# EAGLE design MiMo-Light-V2.0 (EAGLE 8.7.0)
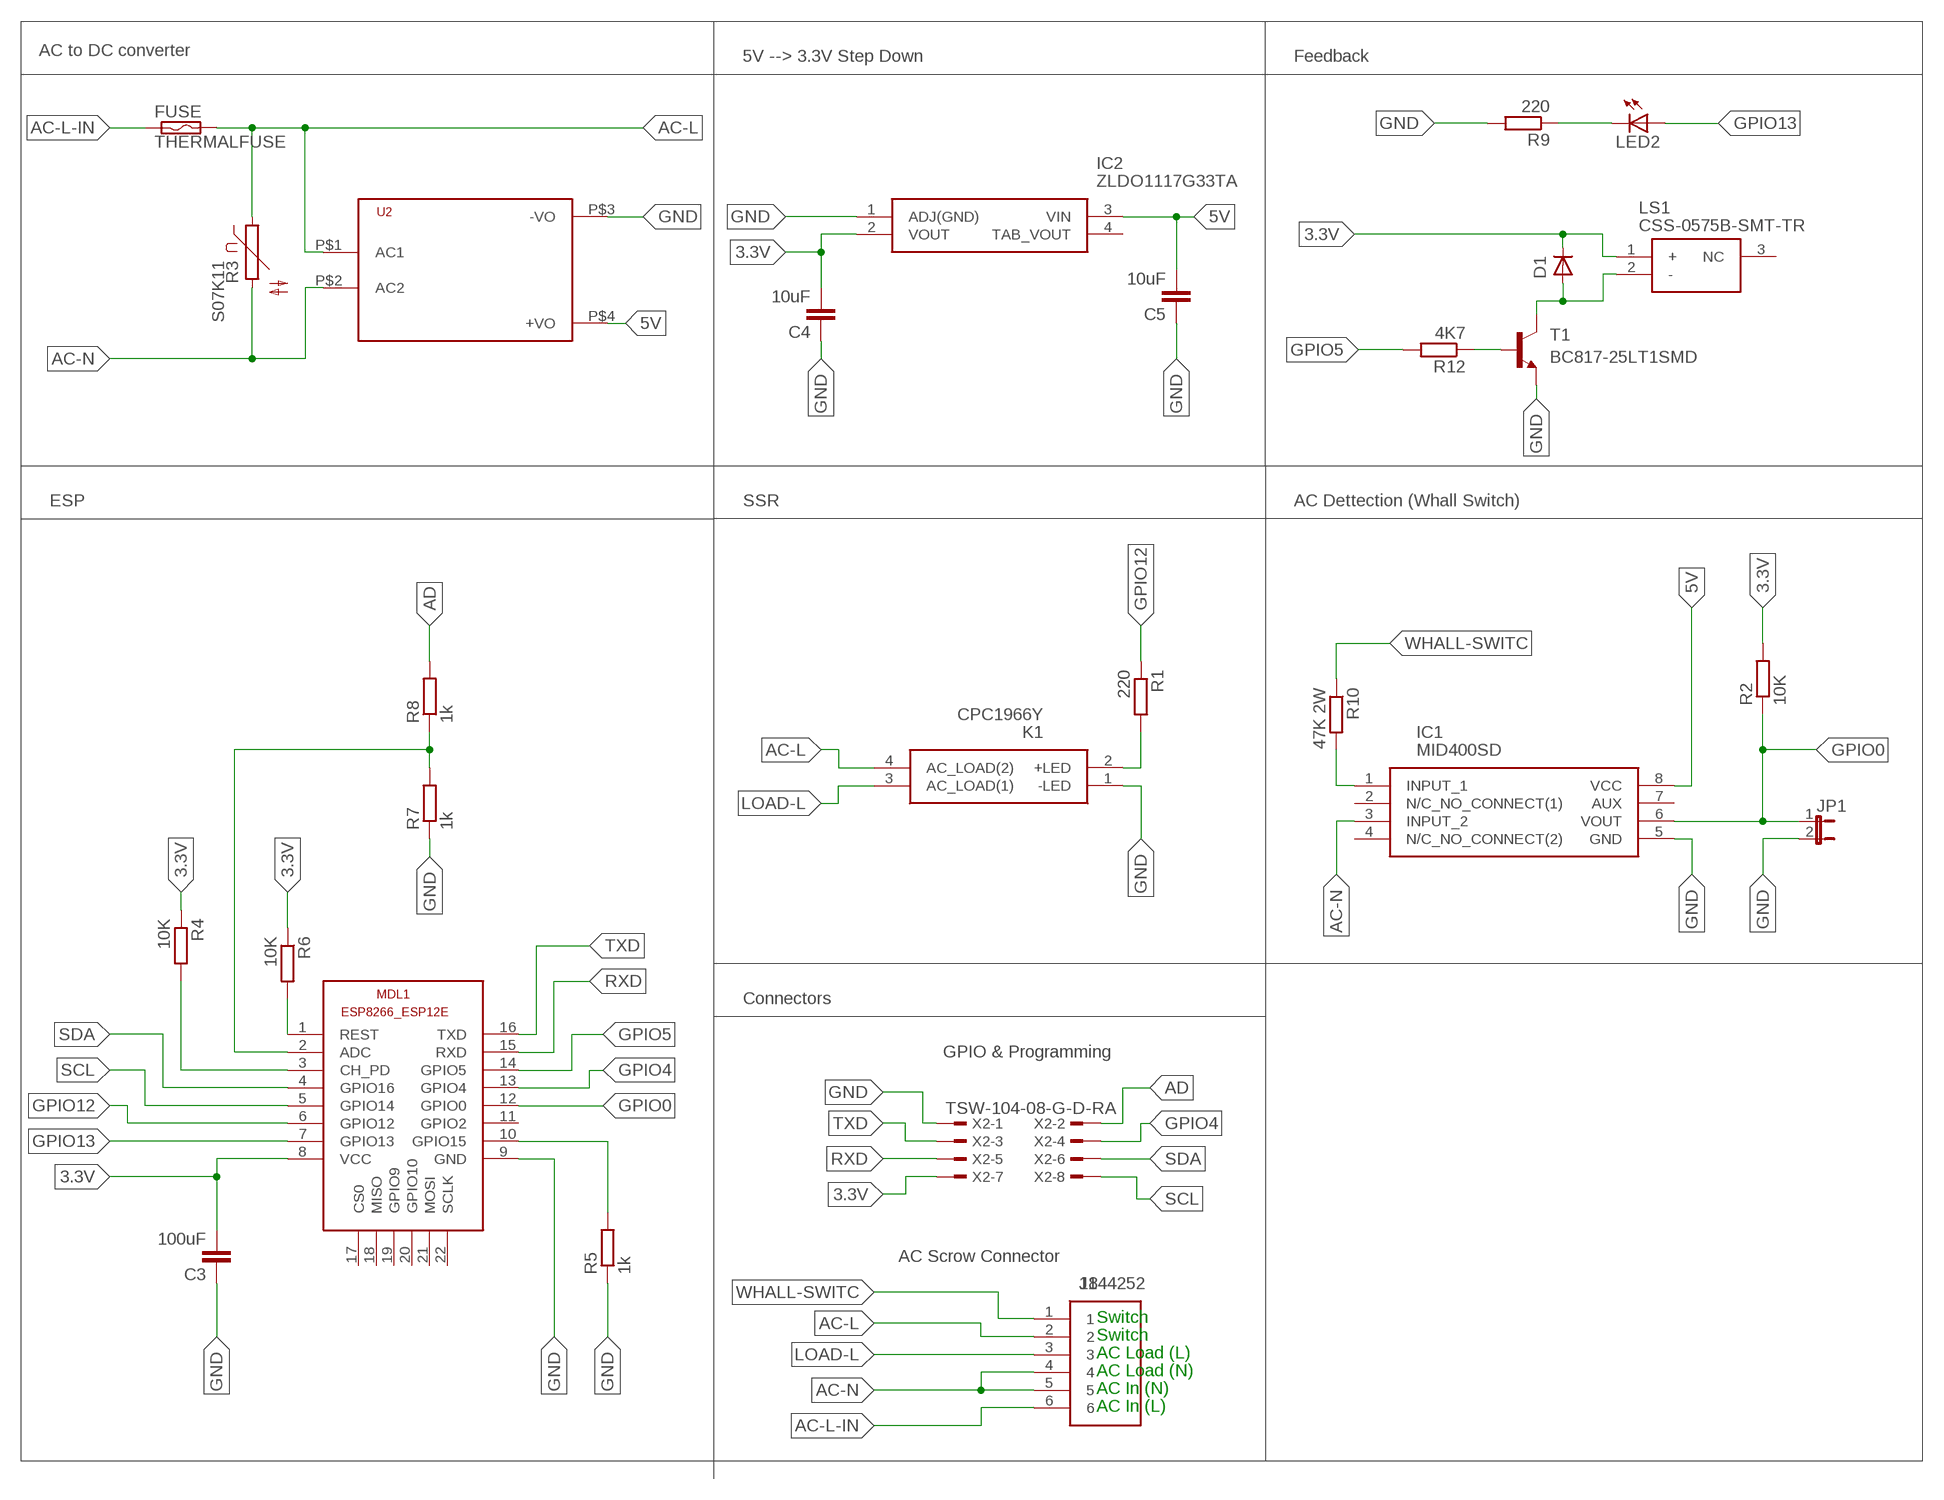
[diagram p0: schematic, sheet 1]

## Parts
C3  100uF  CAP1210  [1210]
C4  10uF  CAP1206  [1206]
C5  10uF  CAP1206  [1206]
D1  DIODE-MINIMELF  [MINIMELF]
FUSE  THERMALFUSE  THERMALFUSE12MM  [TE5]
IC1  MID400SD  [SOP254P1030X508-8N]
IC2  ZLDO1117G33TA  [SOT230P700X180-4N]
J1  1844252  [SHDR6W100P0X350_1X6_2240X920X7]
JP1  JP1E  [JP1]
K1  CPC1966Y  [CPC1966Y]
LED2  LEDCHIPLED_1206  [CHIPLED_1206]
LS1  CSS-0575B-SMT-TR  [CSS-0575B-SMT-TR]
MDL1  ESP8266-12EESP8266-ESP12E  [ESP8266-ESP12E]
R1  220  RR1206  [R1206]
R2  10K  RR1206  [R1206]
R3  S07K11  [S07K11]
R4  10K  RR1206  [R1206]
R5  1k  RR1206  [R1206]
R6  10K  RR1206  [R1206]
R7  1k  RR1206  [R1206]
R8  1k  RR1206  [R1206]
R9  220  RR1206  [R1206]
R10  47K 2W  RR2512  [R2512]
R12  4K7  RR1206  [R1206]
T1  BC817-25LT1SMD  [SOT23-BEC]
U2  HLK-PM013W  [HLK-PM01]
X2  TSW-104-08-G-D-RA  [TSW-104-08-G-D-RA]

## Nets
3.3V: C3.2 C4.2 D1.C IC2.2(VOUT) LS1.1(+) MDL1.8(VCC) R2.2 R4.1 R6.1 X2.7
5V: C5.2 IC1.8(VCC) IC2.3(VIN) U2.P$4(+VO)
AC-DETECT [AC-detect]: IC1.1(INPUT_1) R10.2
AC-L [AC]: FUSE.2 J1.2 K1.4(AC_LOAD(2)) R3.1 U2.P$1(AC1)
AC-L-IN [AC]: FUSE.1 J1.6
AC-N [AC]: IC1.3(INPUT_2) J1.4 J1.5 R3.2 U2.P$2(AC2)
AD: R8.2 X2.2
ADC: MDL1.2(ADC) R7.2 R8.1
GND: C3.1 C4.1 C5.1 IC1.5(GND) IC2.1(ADJ(GND)) JP1.2 K1.1(-LED) MDL1.9(GND) R5.1 R7.1 R9.2 T1.E U2.P$3(-VO) X2.1
GPIO0: IC1.6(VOUT) JP1.1 MDL1.12(GPIO0) R2.1
GPIO4: MDL1.13(GPIO4) X2.4
GPIO5: MDL1.14(GPIO5) R12.2
GPIO12: MDL1.6(GPIO12) R1.1
GPIO13: LED2.A MDL1.7(GPIO13)
LOAD-L [AC]: J1.3 K1.3(AC_LOAD(1))
N$2: LED2.C R9.1
N$3: K1.2(+LED) R1.2
N$5: D1.A LS1.2(-) T1.C
N$6: MDL1.3(CH_PD) R4.2
N$7: R12.1 T1.B
N$8: MDL1.10(GPIO15) R5.2
N$11: MDL1.1(REST) R6.2
RXD: MDL1.15(RXD) X2.5
SCL: MDL1.5(GPIO14) X2.8
SDA: MDL1.4(GPIO16) X2.6
TXD: MDL1.16(TXD) X2.3
WHALL-SWITC [AC-detect]: J1.1 R10.1
Unconnected: IC1.2(N/C_NO_CONNECT(1)) IC1.4(N/C_NO_CONNECT(2)) IC1.7(AUX) IC2.4(TAB_VOUT) LS1.3(NC) MDL1.11(GPIO2) MDL1.17(CS0) MDL1.18(MISO) MDL1.19(GPIO9) MDL1.20(GPIO10) MDL1.21(MOSI) MDL1.22(SCLK)

## Notes on the sheet
- AC to DC converter
- 5V --> 3.3V Step Down | Feedback
- ESP | SSR | AC Dettection (Whall Switch)
- Connectors
- GPIO & Programming
- AC Scrow Connector
- Switch
- Switch
- AC Load (L)
- AC Load (N)
- AC In (N)
- AC In (L)

## Library data of the parts
C3-C5 = SparkFun-Capacitors:CAP: Capacitor Standard 0603 ceramic capacitor, and 0.1" leaded capacitor.
D1 = diode:DIODE-: DIODE
FUSE = Marco-Lib:THERMALFUSE
IC1 = SamacSys_Parts:MID400SD: Logic Output Optocouplers 8-Pin Optocoupler Logic aC Line Source: Datasheet <https://componentsearchengine.com/Datasheets/1/MID400SD.pdf>; DESCRIPTION: Logic Output Optocouplers 8-Pin Optocoupler Logic aC Line; HEIGHT: 5.08mm; MANUFACTURER_NAME: Fairchild Semiconductor; MANUFACTURER_PART_NUMBER: MID400SD; RS_PART_NUMBER: 8064169P; RS_PRICE/STOCK: http://uk.rs-online.com/web/p/products/8064169P
IC2 = SamacSys_Parts:ZLDO1117G33TA: LDO Regulator Pos 3.3V 1A 4Pin SOT223 Diodes Inc ZLDO1117G33TA, Single Linear Voltage Regulator, 1A 3.3 V, 2%, 3-Pin SOT-223 Source: Datasheet <http://uk.rs-online.com/web/p/products/7515183P>; ALLIED_NUMBER: 70438621; DESCRIPTION: LDO Regulator Pos 3.3V 1A 4Pin SOT223 Diodes Inc ZLDO1117G33TA, Single Linear Voltage Regulator, 1A 3.3 V, 2%, 3-Pin SOT-223; HEIGHT: 1.8mm; MANUFACTURER_NAME: Diodes Inc.; MANUFACTURER_PART_NUMBER: ZLDO1117G33TA; RS_PART_NUMBER: 7515183P
J1 = SamacSys_Parts:1844252: Mini PCB header, R/A, 3.5mm pitch, 6 way Source: Datasheet <http://uk.rs-online.com/web/p/products/8042257>; DESCRIPTION: Mini PCB header, R/A, 3.5mm pitch, 6 way; HEIGHT: 7.25mm; MANUFACTURER_NAME: Phoenix Contact; MANUFACTURER_PART_NUMBER: 1844252; RS_PART_NUMBER: 8042257
JP1 = jumper:JP1E: JUMPER
K1 = SamacSys_Parts:CPC1966Y: IXYS 3 A rms SPNO Solid State Relay, Zero Crossing, PCB Mount SCR, 240 V ac Maximum Load Source: Datasheet <http://uk.rs-online.com/web/p/products/9061091>; DESCRIPTION: IXYS 3 A rms SPNO Solid State Relay, Zero Crossing, PCB Mount SCR, 240 V ac Maximum Load; HEIGHT: 10mm; MANUFACTURER_NAME: IXYS SEMICONDUCTOR; MANUFACTURER_PART_NUMBER: CPC1966Y; RS_PART_NUMBER: 9061091
LED2 = led:LED: LED OSRAM: - CHIPLED LG R971, LG N971, LY N971, LG Q971, LY Q971, LO R971, LY R971 LH N974, LH R974 LS Q976, LO Q976, LY Q976 LO Q996 - Hyper CHIPLED LW Q18S LB Q993, LB Q99A, LB R99A - SideLED LS A670, LO A670, LY A670, LG A670, LP A670 LB A673, LV A673, LT A673, LW A673 LH A674 LY A675 LS A676, LA A676, LO A676, LY A676, LW A676 LS A679, LY A679, LG A679 - Hyper Micro SIDELED® LS Y876, LA Y876, LO Y876, LY Y876 LT Y87S - SmartLED LW L88C, LW L88S LB L89C, LB L89S, LG L890 LS L89K, LO L89K, LY L89K LS L896, LA L896, LO L896, LY L896 - TOPLED LS T670, LO T670, LY T670, LG T670, LP T670 LSG T670, LSP T670, LSY T670, LOP T670, LYG T670 LG T671, LOG T671, LSG T671 LB T673, LV T673, LT T673, LW T673 LH T674 LS T676, LA T676, LO T676, LY T676, LB T676, LH T676, LSB T676, LW T676 LB T67C, LV T67C, LT T67C, LS T67K, LO T67K, LY T67K, LW E67C LS E67B, LA E67B, LO E67B, LY E67B, LB E67C, LV E67C, LT E67C LW T67C LS T679, LY T679, LG T679 LS T770, LO T770, LY T770, LG T770, LP T770 LB T773, LV T773, LT T773, LW T773 LH T774 LS E675, LA E675, LY E675, LS T675 LS T776, LA T776, LO T776, LY T776, LB T776 LHGB T686 LT T68C, LB T68C - Hyper Mini TOPLED® LB M676 - Mini TOPLED Santana® LG M470 LS M47K, LO M47K, LY M47K Source: http://www.osram.convergy.de LUXEON: - LUMILED® LXK2-PW12-R00, LXK2-PW12-S00, LXK2-PW14-U00, LXK2-PW14-V00 LXK2-PM12-R00, LXK2-PM12-S00, LXK2-PM14-U00 LXK2-PE12-Q00, LXK2-PE12-R00, LXK2-PE12-S00, LXK2-PE14-T00, LXK2-PE14-U00 LXK2-PB12-K00, LXK2-PB12-L00, LXK2-PB12-M00, LXK2-PB14-N00, LXK2-PB14-P00, LXK2-PB14-Q00 LXK2-PR12-L00, LXK2-PR12-M00, LXK2-PR14-Q00, LXK2-PR14-R00 LXK2-PD12-Q00, LXK2-PD12-R00, LXK2-PD12-S00 LXK2-PH12-R00, LXK2-PH12-S00 LXK2-PL12-P00, LXK2-PL12-Q00, LXK2-PL12-R00 Source: www.luxeon.com KINGBRIGHT: KA-3528ASYC Source: www.kingbright.com
LS1 = SamacSys_Parts:CSS-0575B-SMT-TR: Speakers & Transducers buzzer, 5 mm square, 2.5 mm deep, M, 4 kHz, 3 V, SMT, no driving circuit Source: Datasheet <http://www.cui.com/product/resource/css-0575b-smt.pdf>; DESCRIPTION: Speakers & Transducers buzzer, 5 mm square, 2.5 mm deep, M, 4 kHz, 3 V, SMT, no driving circuit; HEIGHT: mm; MANUFACTURER_NAME: CUI; MANUFACTURER_PART_NUMBER: CSS-0575B-SMT-TR
MDL1 = ESP8266-ESP12E:ESP8266-12E: ESP8266-12E with additional I/O and GPIO04/05 corrected The author cannot warrant that this library is free from error or will meet your specific requirements. Created by PuceBaboon.com. Komagane, Nagano, JAPAN
R1 R2 R4-R10 R12 = eagle-ltspice:R: RESISTOR, European symbol; SPICEMODEL: NONE; SPICEPREFIX: R
R3 = varistor:S07K11: VARISTOR
T1 = transistor-npn:BC817*: NPN Transistor
U2 = HLK-PM01:HLK-PM01: Hi-Link Power Supply HLK-PM01 3W Author: Ahmed Said <https://github.com/AhmedSaid/EAGLELibraries>
X2 = con-samtec:TSW-104-*-G: THROUGH-HOLE .025" SQ POST HEADER Source: Samtec TSW.pdf; MF: Samtec Inc.; MPN: TSW-104-08-G-D-RA

## Net classes
1 AC: width 1.524 mm, clearance 0.762 mm
2 AC-detect: width 0.762 mm, clearance 1.016 mm

## Board
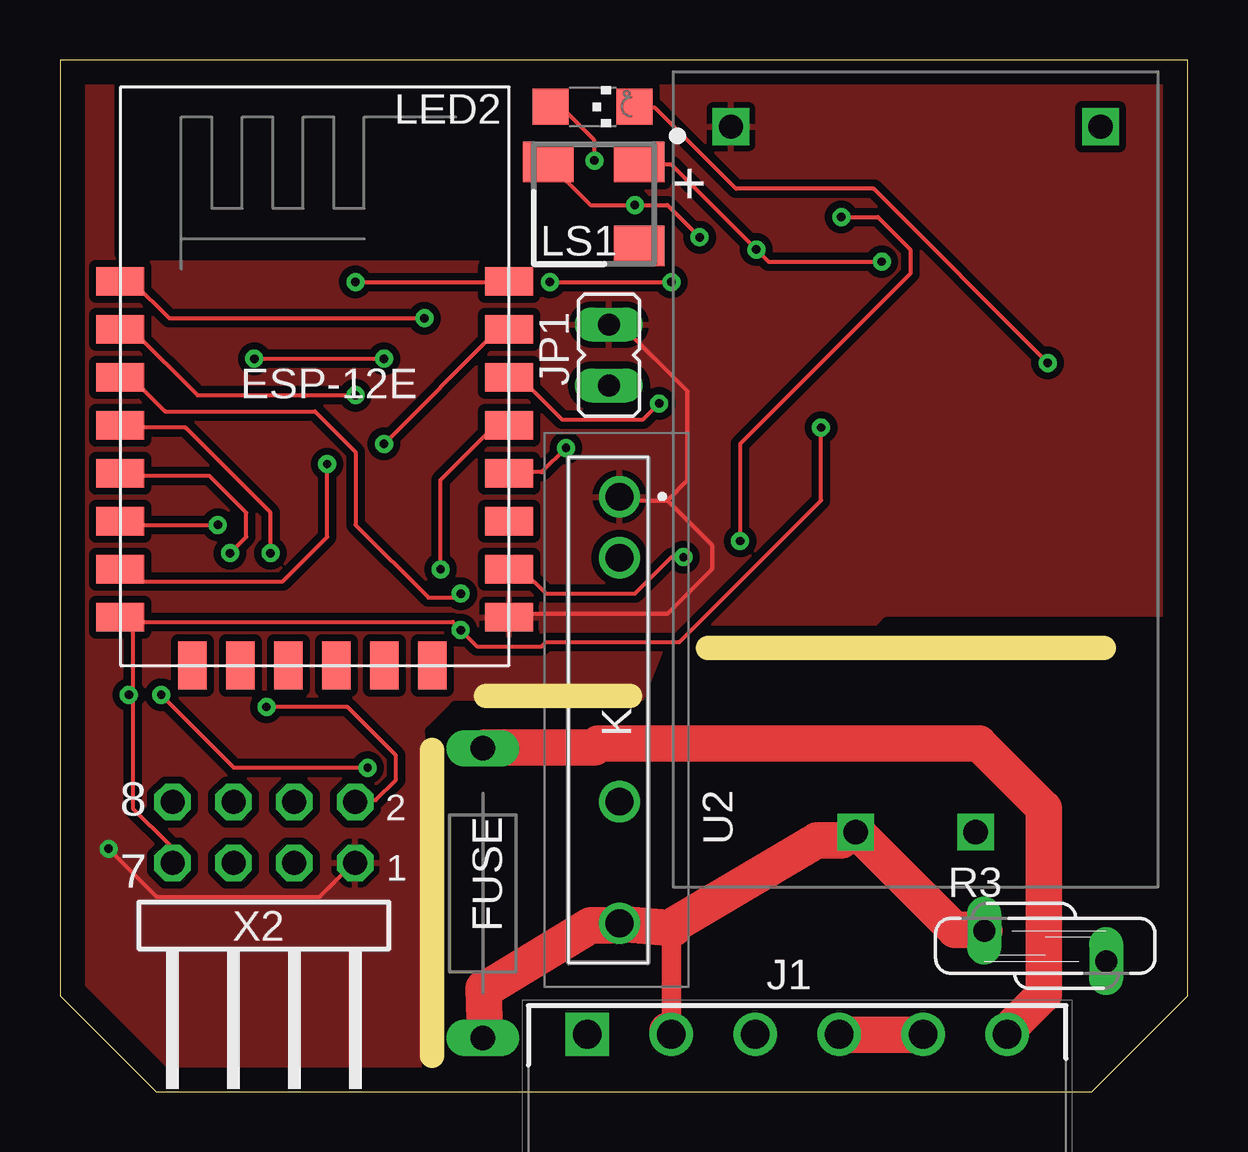
[diagram p1: board, top side]
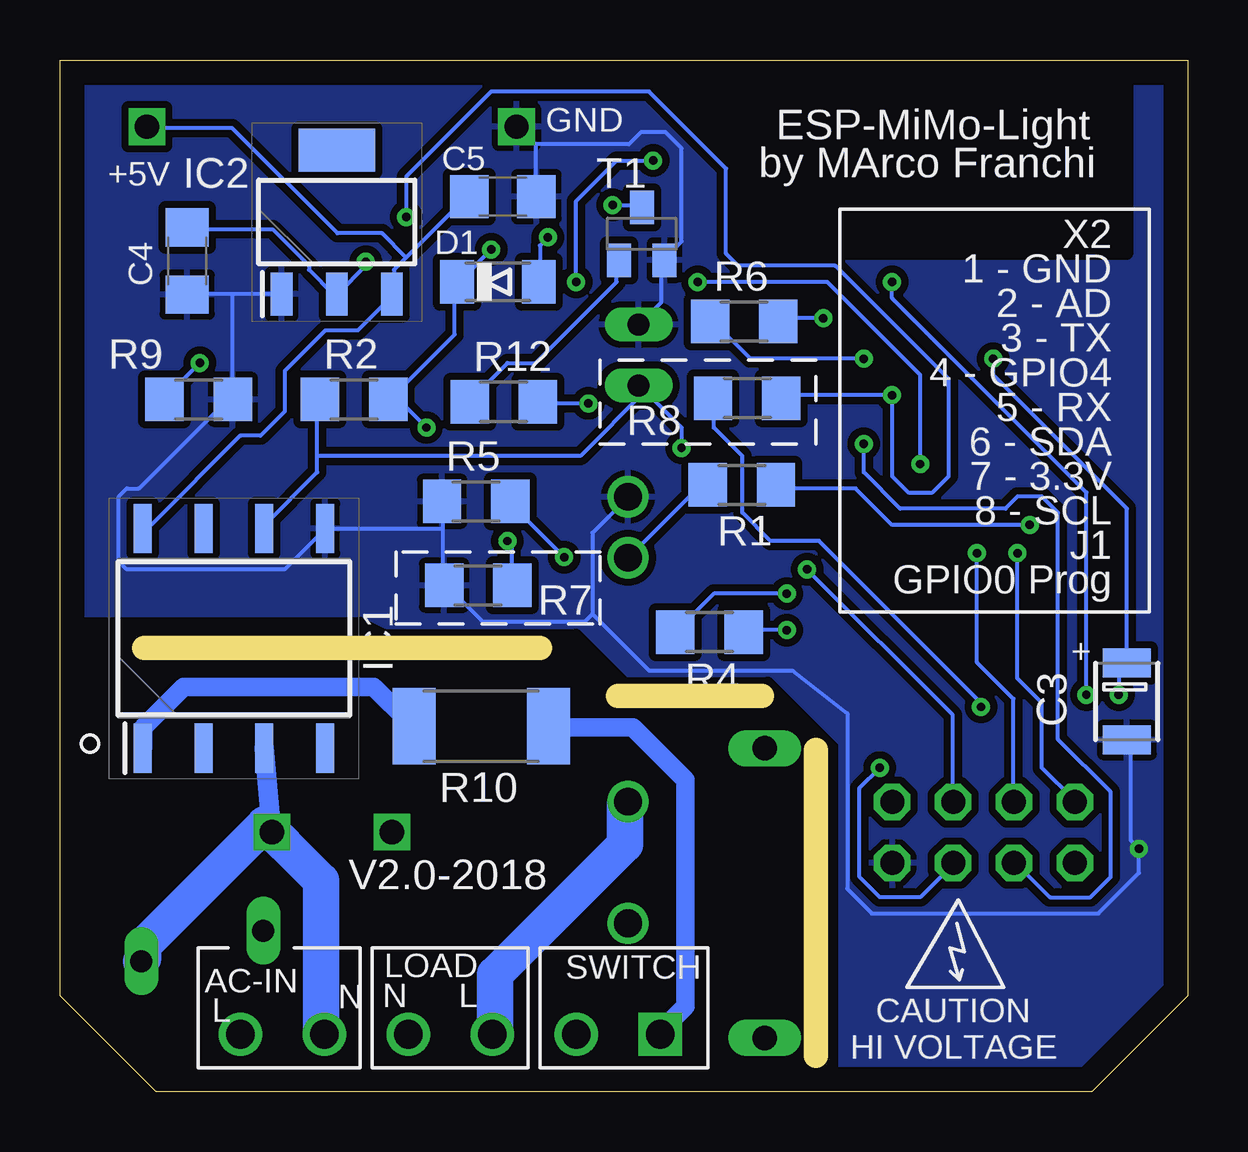
[diagram p2: board, bottom side, seen from below]

Size 47 x 43 mm. Coordinates in mm from the lower left corner, seen from the top.
Outline: 4,0 43,0 47,4 47,43 0,43 0,4 4,0
Copper layers (1*16): Top 0.035mm / dielectric 1.5mm / Bottom 0.035mm
Design rules "MArco-Service": minimum track width 0.175mm, minimum drill 0.35mm, track to track 0.3mm, track to pad 0.5mm, pad to pad 0.5mm, via to via 0.3mm, smd to smd 6mil, copper to edge 40mil, drill to drill 6mil, minimum pad ring 10mil, minimum via ring 0.2mm, stop-mask expansion 4mil, vias tented up to drill 1.5mm, thermal gap 10mil
tRestrict: area 15.5,0 to 47,19.5
bRestrict: area 15.5,0 to 47,19.5
Milling: 3 lines

### Footprints (pad centres in the part's own frame; a part is rotated, then mirrored left to right if it is on the bottom)
1210 = smd 1.2 x 2: 1 -1.6,0; 2 1.6,0
1206 = smd 1.6 x 1.8: 1 -1.4,0; 2 1.4,0
MINIMELF = smd 1.4 x 1.8: A 1.7,0; C -1.7,0
TE5 = drill 1.016 long: 1 -6.04,0; 2 6.04,0
SOP254P1030X508-8N = smd 2.05 x 0.75: 1 -4.575,3.81; 2 -4.575,1.27; 3 -4.575,-1.27; 4 -4.575,-3.81; 5 4.575,-3.81; 6 4.575,-1.27; 7 4.575,1.27; 8 4.575,3.81
SOT230P700X180-4N = smd 1.8 x 0.9: 1 -3,2.3; 2 -3,0; 3 -3,-2.3 | smd 1.8 x 3.2: 4 3,0
SHDR6W100P0X350_1X6_2240X920X7 = drill 1.2 pad 1.8 square: 1 0,0 | drill 1.2 pad 1.8: 2 3.5,0; 3 7,0; 4 10.5,0; 5 14,0; 6 17.5,0
JP1 = drill 0.914 long: 1 0,-1.27; 2 0,1.27
CPC1966Y = drill 1.15 pad 1.725: 1 -8.89,0.123; 2 -6.35,0.123; 3 3.81,0.123; 4 8.89,0.123
CHIPLED_1206 = smd 1.5 x 1.5: A 0,-1.75; C 0,1.75
CSS-0575B-SMT-TR = smd 2.1 x 1.7: 1 -1.9,-1.75; 2 1.9,-1.75; 3 -1.9,1.75
ESP8266-ESP12E = smd 2 x 1.2: 1 -7.62,5.84; 2 -7.62,3.84; 3 -7.62,1.84; 4 -7.62,-0.16; 5 -7.62,-2.16; 6 -7.62,-4.16; 7 -7.62,-6.16; 8 -7.62,-8.16; 9 8.58,-8.16; 10 8.58,-6.16; 11 8.58,-4.16; 12 8.58,-2.16; 13 8.58,-0.16; 14 8.58,1.84; 15 8.58,3.84; 16 8.58,5.84 | smd 1.2 x 2: 17 -4.62,-10.16; 18 -2.62,-10.16; 19 -0.62,-10.16; 20 1.38,-10.16; 21 3.38,-10.16; 22 5.38,-10.16
R1206 = smd 1.6 x 1.803: 1 -1.422,0; 2 1.422,0
S07K11 = drill 0.914 long: 1 -0.635,-2.54; 2 0.635,2.54
R2512 = smd 1.8 x 3.2: 1 -2.8,0; 2 2.8,0
SOT23-BEC = smd 1 x 1.4: B -0.95,-1.1; C 0,1.1; E 0.95,-1.1
HLK-PM01 = drill 1.016 square: P$1 -14.7,2.5; P$2 -14.7,-2.5; P$3 14.7,7.7; P$4 14.7,-7.7
TSW-104-08-G-D-RA = drill 1 pad 1.5 octagon: 1 3.81,1.524; 2 3.81,4.064; 3 1.27,1.524; 4 1.27,4.064; 5 -1.27,1.524; 6 -1.27,4.064; 7 -3.81,1.524; 8 -3.81,4.064

### Placement (x,y rotation side)
C3  2.53,16.26 90 bottom
C4  41.7,34.62 90 bottom
C5  28.54,37.3 180 bottom
D1  28.75,33.75 0 bottom
FUSE  17.63,8.27 270 top
IC1  39.75,18.89 90 bottom
IC2  35.46,36.24 90 bottom
J1  21.98,2.38 0 top
JP1  22.88,30.7 0 top
K1  23.2,15.9 270 top
LED2  22.2,41.05 270 top
LS1  22.25,37 180 top
MDL1  10.14,27.93 0 top
R1  18.58,25.29 180 bottom
R2  34.74,28.85 0 bottom
R3  41.07,6.07 270 top
R4  19.93,19.15 180 bottom
R5  29.65,24.6 0 bottom
R6  18.48,32.1 0 bottom
R7  29.56,21.1 0 bottom
R8  18.36,28.9 180 bottom
R9  41.22,28.85 0 bottom
R10  29.44,15.23 180 bottom
R12  28.5,28.75 0 bottom
T1  22.75,35.75 0 bottom
U2  35.67,25.52 90 top
X2  8.5,8 0 top

### Tracks (layer width: path | path; a pad name or v marks a point on that pad's centre or on a via)
3.3V  (via drill 0.35)
  Top 0.175: LS1.1 24.3,38.64 25.48,38.64 v29.02,35.1 29.53,34.59 v34.26,34.59 | 3.04,19.57 2.7,19.57 2.53,19.74 MDL1.8 3.04,19.57 | 3.04,19.57 16.37,19.57 v16.71,19.24 17.38,18.56 20.08,18.56 20.25,18.73 25.82,18.73 31.73,24.64 v31.73,27.68 | 3.04,19.57 3.04,16.54 | 3.04,16.54 3.04,11.81 4.56,10.29 4.56,9.62 X2.7 | v8.1,30.54 v13.5,30.54 | v2.87,16.54 3.04,16.54
  Bottom 0.175: C4.2 41.68,35.94 38.14,35.94 36.62,34.42 36.62,34.26 35.61,33.24 IC2.2 35.44,33.24 34.26,34.42 v34.26,34.59 | 33.08,29.02 33.24,28.86 R2.2 33.08,29.02 | 33.08,29.02 30.54,31.56 30.54,33.75 D1.C 30.38,33.75 v29.02,35.1 | v16.71,19.24 18.39,19.24 R4.1 | v13.5,30.54 18.23,30.54 19.74,32.06 R6.1 | v8.1,30.54 8.1,29.87 2.53,24.3 2.53,17.89 C3.2 2.53,17.72 2.87,17.38 v2.87,16.54 | v31.73,27.68 33.08,29.02
5V
  Bottom 0.175: 32.57,34.76 30.04,37.29 C5.2 | 32.57,34.76 33.08,34.26 33.08,33.24 IC2.3 33.24,33.08 34.59,31.73 35.94,31.73 37.63,30.04 37.63,28.35 38.64,27.34 39.49,27.34 43.2,23.62 43.54,23.62 IC1.8 | 32.57,34.76 33.58,35.77 35.44,35.77 39.83,40.16 43.37,40.16 U2.P$4
AC-DETECT
  Bottom 0.762: IC1.1 43.54,14.34 43.54,15.19 41.85,16.88 33.92,16.88 32.4,15.36 R10.2
AC-L
  Top 0.813: J1.2 25.48,6.25 25.5,6.25 25.5,6.89 25.49,6.89
  Top 1.524: R3.1 38.48,6.75 37.29,6.75 33.24,10.8 U2.P$1 32.57,10.46 31.56,10.46 25.49,6.89 25.56,6.81 23.38,6.99 K1.4 23.29,6.92 22.11,6.92 17.66,4.22 17.66,4.3 17.72,2.36 FUSE.2 | 25.31,2.53 J1.2
AC-L-IN
  Top 1.524: FUSE.1 17.72,14.34 22.27,14.34 22.44,14.51 38.31,14.51 41.01,11.81 41.01,4.05 39.49,2.53 J1.6
AC-N
  Top 1.524: J1.4 32.57,2.36 35.94,2.36 J1.5
  Bottom 0.813: U2.P$2 IC1.3
  Bottom 1.524: R3.2 43.54,5.57 43.54,6.08 38.48,11.14 38.31,10.97 U2.P$2 37.63,10.29 36.11,8.78 36.11,2.53 J1.5
AD  (via drill 0.35)
  Top 0.175: v8.61,16.03 11.98,16.03 14.01,14.01 14.01,12.99 13.16,12.15 12.32,12.15 X2.2
  Bottom 0.175: v8.61,16.03 8.61,16.2 15.36,22.95 17.38,22.95 18.56,24.13 18.56,26.49 19.74,27.68 19.74,28.86 R8.2
ADC  (via drill 0.35)
  Top 0.175: v12.32,29.02 5.74,29.02 3.04,31.73 2.53,31.73 MDL1.2 | v28.35,22.95 28.35,27 35.44,34.09 35.44,35.1 34.09,36.45 v32.57,36.45
  Bottom 0.175: R8.1 16.88,29.02 v12.32,29.02 12.32,25.65 11.64,24.98 10.63,24.98 9.96,25.65 9.96,29.7 14.68,34.42 18.73,34.42 19.24,34.93 19.24,38.48 22.44,41.68 29.02,41.68 32.57,38.14 v32.57,36.45 | v28.35,22.95 28.18,22.78 28.18,21.26 R7.2
GND  (via drill 0.35)
  Top 0.175: v2.02,10.12 4.05,8.1 10.8,8.1 12.15,9.45 X2.1 | 25.31,24.64 27.17,22.78 27.17,21.77 25.31,19.91 18.73,19.91 MDL1.9 | 25.31,24.64 23.46,24.64 K1.1 | 25.31,24.64 26.16,25.48 26.16,29.19 23.46,31.89 22.95,31.89 JP1.2
  Bottom 0.175: 39.83,33.24 37.8,33.24 IC2.1 | 39.83,33.24 41.68,33.24 C4.1 | 39.83,33.24 39.83,28.86 R9.2 39.83,28.69 40.16,28.69 43.71,25.14 44.21,25.14 44.55,24.81 44.55,22.11 44.21,21.77 37.63,21.77 IC1.5 35.77,23.46 31.05,23.46 | 31.05,23.46 31.05,24.47 R5.1 | 31.05,23.46 31.05,21.26 R7.1 30.88,21.09 29.36,19.57 25.14,19.57 24.81,19.91 | C3.1 2.36,14.51 2.36,10.46 v2.02,10.12 2.02,9.11 3.71,7.42 13.16,7.42 14.19,8.45 14.19,15.77 16.47,17.55 22.44,17.55 24.81,19.91 | 27.17,39.49 27.17,37.46 C5.1 | 27.17,39.49 27.84,40.16 U2.P$3 | JP1.2 22.78,32.06 21.94,32.91 21.94,34.59 T1.E 21.77,34.76 21.09,35.44 21.09,39.32 21.77,39.99 22.78,39.99 23.29,39.49 27.17,39.49 | 24.81,19.91 24.81,23.29 23.46,24.64 K1.1
  pour Top (isolate 0.254): 0,3.75 0,43 46.75,43 47,42.75 47,19.5 26.5,19.5 24,16 16.5,16 15,14.5 15,0 4,0 0.25,3.75
  pour Bottom (isolate 0.254): 0,3.75 0,43 46.75,43 47,42.75 47,19.5 34.75,19.5 33.75,18.5 26.5,18.5 24,16.5 16.5,16.5 14.5,14.5 14.5,0 4,0 0.25,3.75
GPIO0  (via drill 0.35)
  Top 0.175: v21.09,26.83 20.08,25.82 18.73,25.82 MDL1.12
  Bottom 0.175: 36.28,26.49 36.28,25.82 38.48,23.62 IC1.6 | 36.28,26.49 36.28,28.69 R2.1 | v21.09,26.83 21.09,27.68 22.61,29.19 | 22.61,29.19 22.78,29.36 JP1.1 22.61,29.19 | 36.28,26.49 25.31,26.49 22.61,29.19
GPIO4  (via drill 0.35)
  Top 0.175: v15.86,21.77 15.86,25.48 18.06,27.68 18.56,27.68 MDL1.13
  Bottom 0.175: v15.86,21.77 9.79,15.69 9.79,12.15 X2.4
GPIO5  (via drill 0.35)
  Top 0.175: v24.98,28.69 24.3,28.01 20.93,28.01 19.24,29.7 18.73,29.7 MDL1.14
  Bottom 0.175: v24.98,28.69 27,28.69 R12.2
GPIO12  (via drill 0.35)
  Top 0.175: v6.58,23.62 2.53,23.62 MDL1.6
  Bottom 0.175: v6.58,23.62 12.32,23.62 13.84,25.14 17.04,25.14 R1.1
GPIO13  (via drill 0.35)
  Top 0.175: v22.27,38.81 22.27,39.66 20.93,41.01 20.59,41.01 LED2.A | v20.42,33.75 v25.48,33.75 | v11.14,26.16 11.14,23.12 9.28,21.26 3.04,21.26 2.53,21.77 MDL1.7
  Bottom 0.175: v22.27,38.81 23.79,38.81 25.48,37.12 v25.48,33.75 | v20.42,33.75 15.02,33.75 11.14,29.87 v11.14,26.16
LOAD-L
  Bottom 1.524: K1.3 23.46,11.98 23.46,10.29 28.86,4.89 28.86,2.53 J1.3
N$2  (via drill 0.35)
  Top 0.175: v41.17,30.38 33.92,37.63 28.18,37.63 24.81,41.01 23.96,41.01 LED2.C
  Bottom 0.175: v41.17,30.38 42.69,28.86 R9.1
N$3
  Bottom 0.175: R1.2 20.08,25.14 20.42,25.14 23.29,22.27 K1.2
N$5  (via drill 0.35)
  Top 0.175: LS1.2 20.42,38.64 22.11,36.96 v23.96,36.96 25.31,36.96 v26.66,35.61
  Bottom 0.175: v23.96,36.96 22.78,36.96 T1.C | v26.66,35.61 27,35.27 27,33.75 D1.A
N$6  (via drill 0.35)
  Top 0.175: v16.71,20.76 16.54,20.76 16.37,20.59 15.36,20.59 12.32,23.62 12.32,26.66 10.63,28.35 4.39,28.35 3.04,29.7 2.53,29.7 MDL1.3
  Bottom 0.175: v16.71,20.76 19.74,20.76 21.26,19.24 R4.2
N$7
  Bottom 0.175: T1.B 23.79,34.59 23.79,33.75 27.17,30.38 28.35,30.38 29.87,28.86 R12.1
N$8  (via drill 0.35)
  Top 0.175: v25.99,22.27 25.48,22.27 23.96,20.76 20.25,20.76 19.24,21.77 18.73,21.77 MDL1.10
  Bottom 0.175: v25.99,22.27 28.18,24.47 R5.2
N$11  (via drill 0.35)
  Top 0.175: v15.19,32.23 4.56,32.23 3.04,33.75 2.53,33.75 MDL1.1
  Bottom 0.175: v15.19,32.23 17.04,32.23 R6.2
RXD  (via drill 0.35)
  Top 0.175: v13.5,27 18.23,31.73 18.56,31.73 MDL1.15
  Bottom 0.175: v13.5,27 13.5,25.82 11.98,24.3 7.59,24.3 7.09,24.81 6.08,24.81 5.4,24.13 5.4,14.68 3.21,12.49 3.21,8.94 4.05,8.1 5.74,8.1 7.09,9.45 X2.5
SCL  (via drill 0.35)
  Top 0.175: v7.09,22.44 7.76,23.12 7.76,24.13 6.24,25.65 2.53,25.65 MDL1.5
  Bottom 0.175: v7.09,22.44 7.09,17.21 6.08,16.2 6.08,13.5 4.72,12.15 X2.8
SDA  (via drill 0.35)
  Top 0.175: v8.78,22.44 8.78,24.13 5.23,27.68 2.53,27.68 MDL1.4
  Bottom 0.175: v8.78,22.44 8.78,17.89 7.26,16.37 7.26,12.15 X2.6
TXD  (via drill 0.35)
  Top 0.175: v12.32,33.75 18.56,33.75 MDL1.16 | v4.22,16.54 7.26,13.5 v12.82,13.5
  Bottom 0.175: v12.32,33.75 12.32,33.08 4.22,24.98 v4.22,16.54 | v12.82,13.5 13.67,12.66 13.67,8.94 12.82,8.1 11.14,8.1 9.79,9.45 X2.3
WHALL-SWITC
  Bottom 0.762: R10.1 26.49,15.19 23.12,15.19 20.93,12.99 20.93,3.54 21.94,2.53 J1.1

### Text on the board
tNames: + | 8 | 7
bNames: GND | ESP-MiMo-Light / by MArco Franchi | +5V | X2 / 1 - GND / 2 - AD / 3 - TX / 4 - GPIO4 / 5 - RX / 6 - SDA / 7 - 3.3V / 8 - SCL / J1 / GPIO0 Prog | + | V2.0-2018 | SWITCH | LOAD | L | N | AC-IN | N | L | CAUTION / HI VOLTAGE